# Altium project QMK_PERI_CORNIX_V3.PrjPcb
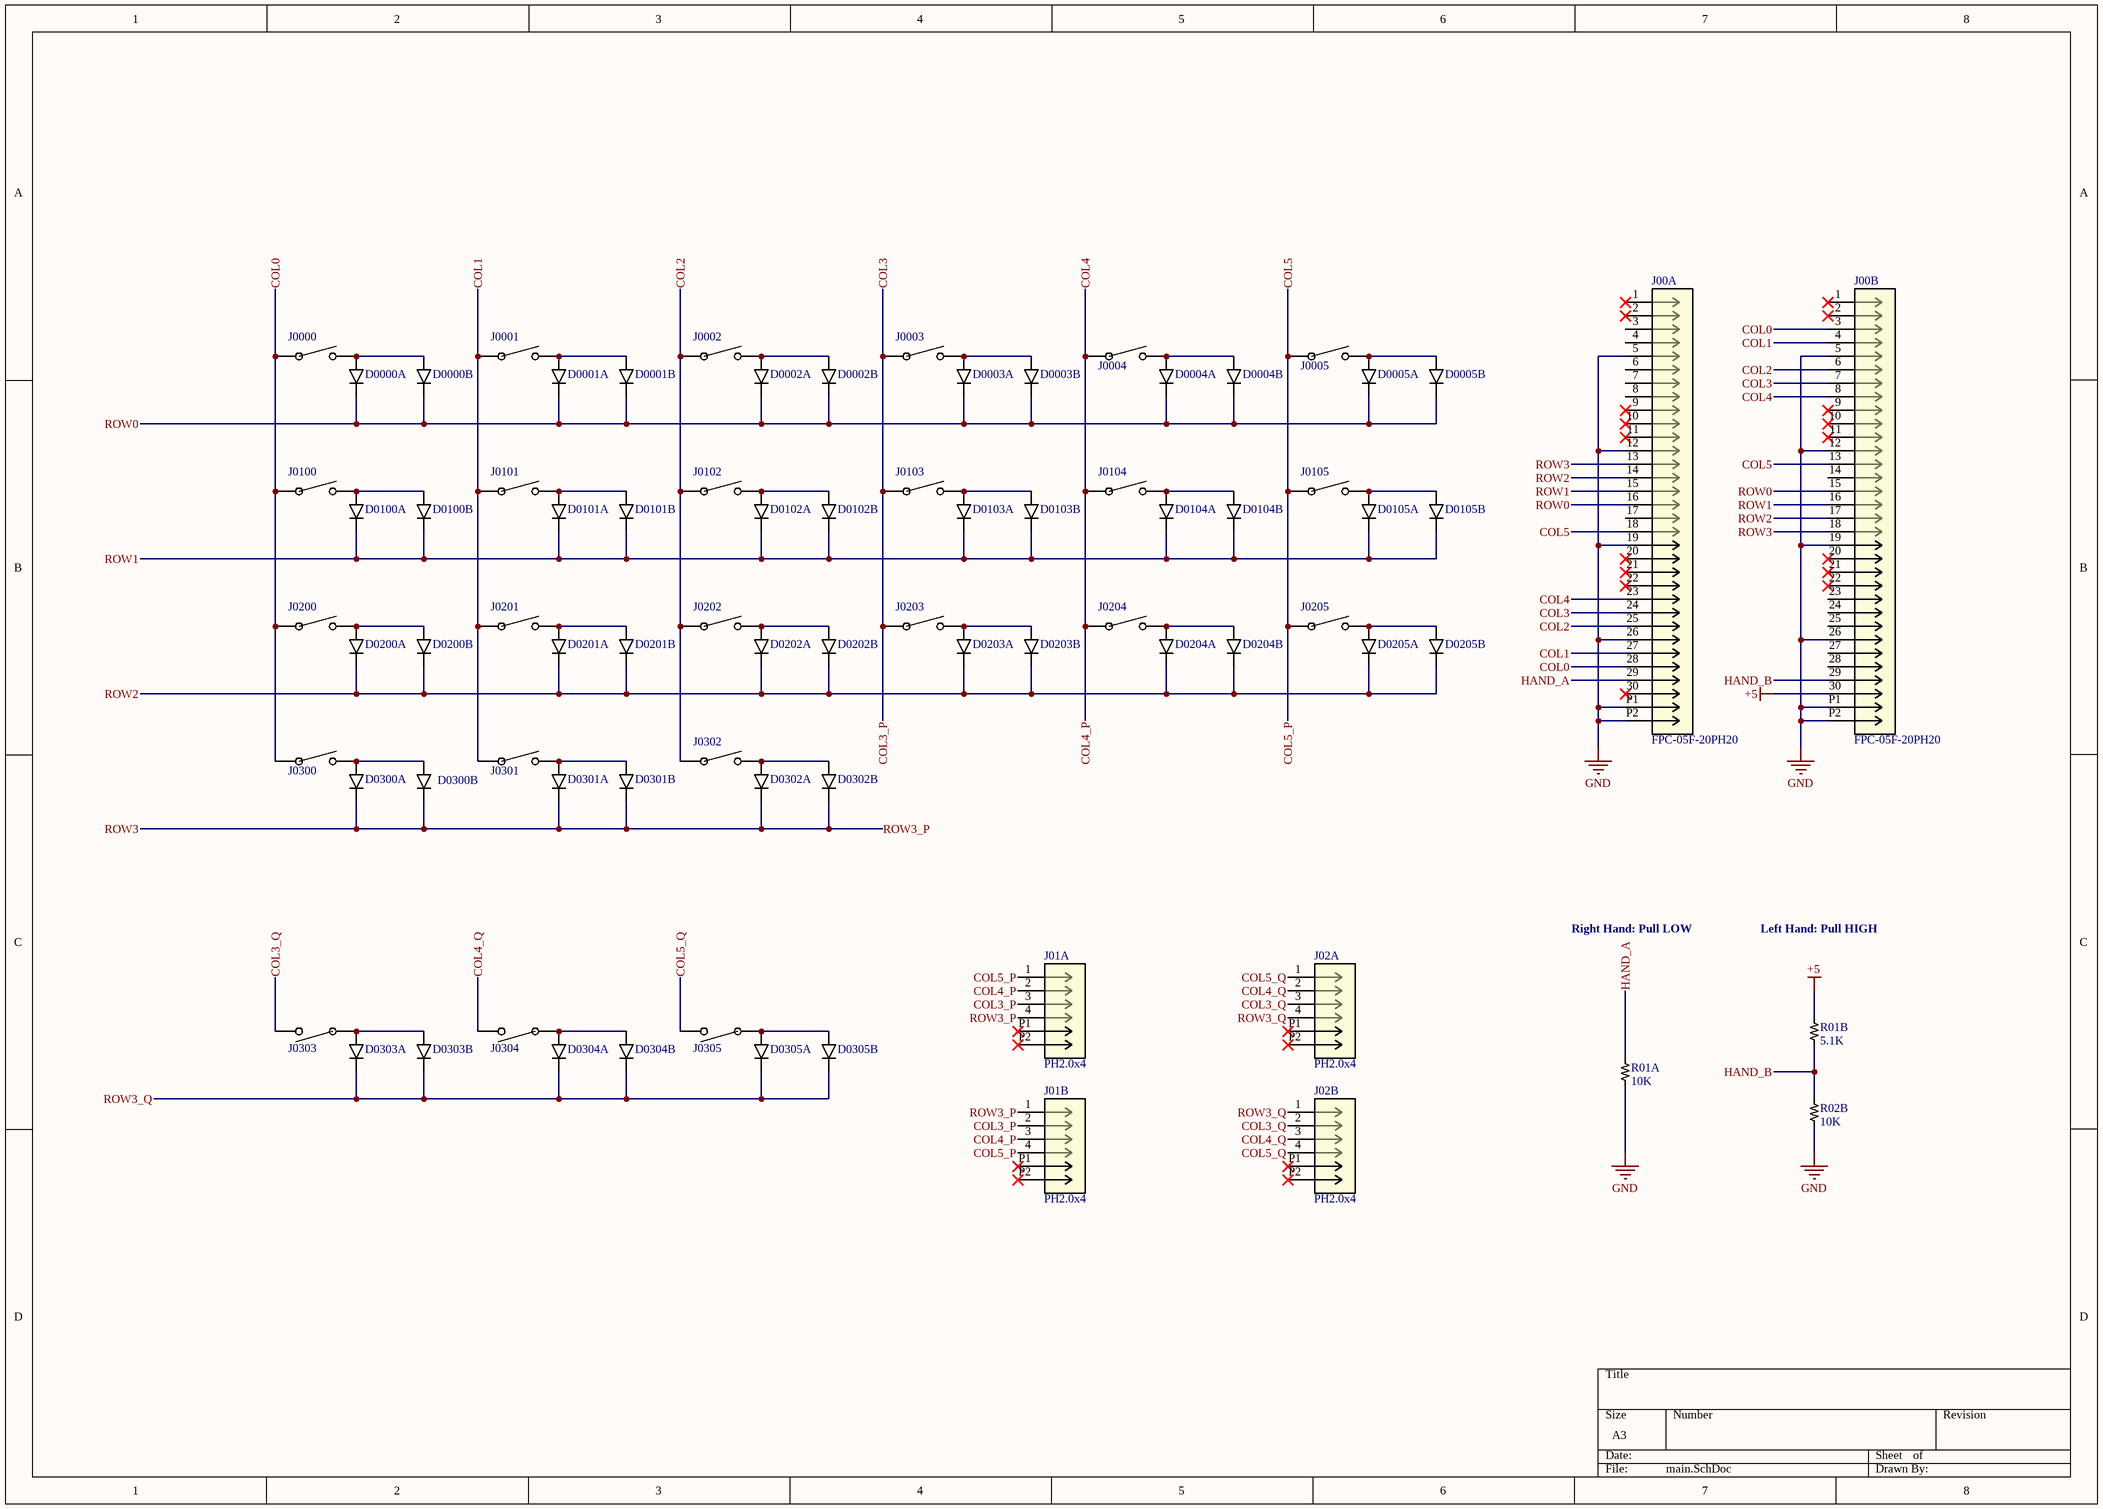
[diagram p0: main.SchDoc]
1 sheet, 81 parts. Net scope: global (net labels, ports and power ports of the same name join across sheets).
Board file: main_V3.0.PcbDoc

## Sheet main.SchDoc
size A3; SheetNumber: 1; SheetTotal: 1

### Parts
D0000A  1N4148W  [SOD123_DIO]  (value not drawn)
D0000B  1N4148W  [SOD123_DIO]  (value not drawn)
D0001A  1N4148W  [SOD123_DIO]  (value not drawn)
D0001B  1N4148W  [SOD123_DIO]  (value not drawn)
D0002A  1N4148W  [SOD123_DIO]  (value not drawn)
D0002B  1N4148W  [SOD123_DIO]  (value not drawn)
D0003A  1N4148W  [SOD123_DIO]  (value not drawn)
D0003B  1N4148W  [SOD123_DIO]  (value not drawn)
D0004A  1N4148W  [SOD123_DIO]  (value not drawn)
D0004B  1N4148W  [SOD123_DIO]  (value not drawn)
D0005A  1N4148W  [SOD123_DIO]  (value not drawn)
D0005B  1N4148W  [SOD123_DIO]  (value not drawn)
D0100A  1N4148W  [SOD123_DIO]  (value not drawn)
D0100B  1N4148W  [SOD123_DIO]  (value not drawn)
D0101A  1N4148W  [SOD123_DIO]  (value not drawn)
D0101B  1N4148W  [SOD123_DIO]  (value not drawn)
D0102A  1N4148W  [SOD123_DIO]  (value not drawn)
D0102B  1N4148W  [SOD123_DIO]  (value not drawn)
D0103A  1N4148W  [SOD123_DIO]  (value not drawn)
D0103B  1N4148W  [SOD123_DIO]  (value not drawn)
D0104A  1N4148W  [SOD123_DIO]  (value not drawn)
D0104B  1N4148W  [SOD123_DIO]  (value not drawn)
D0105A  1N4148W  [SOD123_DIO]  (value not drawn)
D0105B  1N4148W  [SOD123_DIO]  (value not drawn)
D0200A  1N4148W  [SOD123_DIO]  (value not drawn)
D0200B  1N4148W  [SOD123_DIO]  (value not drawn)
D0201A  1N4148W  [SOD123_DIO]  (value not drawn)
D0201B  1N4148W  [SOD123_DIO]  (value not drawn)
D0202A  1N4148W  [SOD123_DIO]  (value not drawn)
D0202B  1N4148W  [SOD123_DIO]  (value not drawn)
D0203A  1N4148W  [SOD123_DIO]  (value not drawn)
D0203B  1N4148W  [SOD123_DIO]  (value not drawn)
D0204A  1N4148W  [SOD123_DIO]  (value not drawn)
D0204B  1N4148W  [SOD123_DIO]  (value not drawn)
D0205A  1N4148W  [SOD123_DIO]  (value not drawn)
D0205B  1N4148W  [SOD123_DIO]  (value not drawn)
D0300A  1N4148W  [SOD123_DIO]  (value not drawn)
D0300B  1N4148W  [SOD123_DIO]  (value not drawn)
D0301A  1N4148W  [SOD123_DIO]  (value not drawn)
D0301B  1N4148W  [SOD123_DIO]  (value not drawn)
D0302A  1N4148W  [SOD123_DIO]  (value not drawn)
D0302B  1N4148W  [SOD123_DIO]  (value not drawn)
D0303A  1N4148W  [SOD123_DIO]  (value not drawn)
D0303B  1N4148W  [SOD123_DIO]  (value not drawn)
D0304A  1N4148W  [SOD123_DIO]  (value not drawn)
D0304B  1N4148W  [SOD123_DIO]  (value not drawn)
D0305A  1N4148W  [SOD123_DIO]  (value not drawn)
D0305B  1N4148W  [SOD123_DIO]  (value not drawn)
J0000  Gateron_V2  [Gateron_V2]  (value not drawn)
J00A  FPC-05F-20PH20  [FPC-05F-30PH20]
J00B  FPC-05F-20PH20  [FPC-05F-30PH20]
J0001  Gateron_V2  [Gateron_V2]  (value not drawn)
J01A  PH2.0x4  [PH2.0x4P]
J01B  PH2.0x4  [PH2.0x4P]
J0002  Gateron_V2  [Gateron_V2]  (value not drawn)
J02A  PH2.0x4  [PH2.0x4P]
J02B  PH2.0x4  [PH2.0x4P]
J0003  Gateron_V2  [Gateron_V2]  (value not drawn)
J0004  Gateron_V2  [Gateron_V2]  (value not drawn)
J0005  Gateron_V2  [Gateron_V2]  (value not drawn)
J0100  Gateron_V2  [Gateron_V2]  (value not drawn)
J0101  Gateron_V2  [Gateron_V2]  (value not drawn)
J0102  Gateron_V2  [Gateron_V2]  (value not drawn)
J0103  Gateron_V2  [Gateron_V2]  (value not drawn)
J0104  Gateron_V2  [Gateron_V2]  (value not drawn)
J0105  Gateron_V2  [Gateron_V2]  (value not drawn)
J0200  Gateron_V2  [Gateron_V2]  (value not drawn)
J0201  Gateron_V2  [Gateron_V2]  (value not drawn)
J0202  Gateron_V2  [Gateron_V2]  (value not drawn)
J0203  Gateron_V2  [Gateron_V2]  (value not drawn)
J0204  Gateron_V2  [Gateron_V2]  (value not drawn)
J0205  Gateron_V2  [Gateron_V2]  (value not drawn)
J0300  Gateron_V2  [Gateron_V2]  (value not drawn)
J0301  Gateron_V2  [Gateron_V2]  (value not drawn)
J0302  Gateron_V2  [Gateron_V2]  (value not drawn)
J0303  Gateron_V2  [Gateron_V2]  (value not drawn)
J0304  Gateron_V2  [Gateron_V2]  (value not drawn)
J0305  Gateron_V2  [Gateron_V2]  (value not drawn)
R01A  10K  [RES0402_CPF_TYCO_TYC]
R01B  5.1K  [RES0402_CPF_TYCO_TYC]
R02B  10K  [RES0402_CPF_TYCO_TYC]

### Nets
+5: J00B.30 R01B.1
GND: J00A.5 J00A.12 J00A.19 J00A.26 J00A.P1 J00A.P2 J00B.5 J00B.12 J00B.19 J00B.26 J00B.P1 J00B.P2 R01A.2 R02B.2
COL0: J0000.1 J00A.28 J00B.3 J0100.1 J0200.1 J0300.1
COL1: J00A.27 J00B.4 J0001.1 J0101.1 J0201.1 J0301.1
COL2: J00A.25 J00B.6 J0002.1 J0102.1 J0202.1 J0302.1
COL3: J00A.24 J00B.7 J01A.3 J01B.2 J0003.1 J0103.1 J0203.1  [also labelled COL3_P]
COL3_Q: J02A.3 J02B.2 J0303.2
COL4: J00A.23 J00B.8 J01A.2 J01B.3 J0004.1 J0104.1 J0204.1  [also labelled COL4_P]
COL4_Q: J02A.2 J02B.3 J0304.2
COL5: J00A.18 J00B.13 J01A.1 J01B.4 J0005.1 J0105.1 J0205.1  [also labelled COL5_P]
COL5_Q: J02A.1 J02B.4 J0305.2
HAND_A: J00A.29 R01A.1
HAND_B: J00B.29 R01B.2 R02B.1
ROW0: D0000A.K D0000B.K D0001A.K D0001B.K D0002A.K D0002B.K D0003A.K D0003B.K D0004A.K D0004B.K D0005A.K D0005B.K J00A.16 J00B.15
ROW1: D0100A.K D0100B.K D0101A.K D0101B.K D0102A.K D0102B.K D0103A.K D0103B.K D0104A.K D0104B.K D0105A.K D0105B.K J00A.15 J00B.16
ROW2: D0200A.K D0200B.K D0201A.K D0201B.K D0202A.K D0202B.K D0203A.K D0203B.K D0204A.K D0204B.K D0205A.K D0205B.K J00A.14 J00B.17
ROW3: D0300A.K D0300B.K D0301A.K D0301B.K D0302A.K D0302B.K J00A.13 J00B.18 J01A.4 J01B.1  [also labelled ROW3_P]
ROW3_Q: D0303A.K D0303B.K D0304A.K D0304B.K D0305A.K D0305B.K J02A.4 J02B.1
NetD0000A_A: D0000A.A D0000B.A J0000.2
NetD0001A_A: D0001A.A D0001B.A J0001.2
NetD0002A_A: D0002A.A D0002B.A J0002.2
NetD0003A_A: D0003A.A D0003B.A J0003.2
NetD0004A_A: D0004A.A D0004B.A J0004.2
NetD0005A_A: D0005A.A D0005B.A J0005.2
NetD0100A_A: D0100A.A D0100B.A J0100.2
NetD0101A_A: D0101A.A D0101B.A J0101.2
NetD0102A_A: D0102A.A D0102B.A J0102.2
NetD0103A_A: D0103A.A D0103B.A J0103.2
NetD0104A_A: D0104A.A D0104B.A J0104.2
NetD0105A_A: D0105A.A D0105B.A J0105.2
NetD0200A_A: D0200A.A D0200B.A J0200.2
NetD0201A_A: D0201A.A D0201B.A J0201.2
NetD0202A_A: D0202A.A D0202B.A J0202.2
NetD0203A_A: D0203A.A D0203B.A J0203.2
NetD0204A_A: D0204A.A D0204B.A J0204.2
NetD0205A_A: D0205A.A D0205B.A J0205.2
NetD0300A_A: D0300A.A D0300B.A J0300.2
NetD0301A_A: D0301A.A D0301B.A J0301.2
NetD0302A_A: D0302A.A D0302B.A J0302.2
NetD0303A_A: D0303A.A D0303B.A J0303.1
NetD0304A_A: D0304A.A D0304B.A J0304.1
NetD0305A_A: D0305A.A D0305B.A J0305.1

Not connected (* = marked no-connect by the designer): J00A 1* 2* 3 4 6 7 8 9* 10* 11* 17 20* 21* 22* 30*; J00B 1* 2* 9* 10* 11* 14 20* 21* 22* 23 24 25 27 28; J01A P1* P2*; J01B P1* P2*; J02A P1* P2*; J02B P1* P2*

### Notes on the sheet
- Right Hand: Pull LOW
- Left Hand: Pull HIGH

### Library data of the parts
D0000A D0000B D0001A D0001B D0002A D0002B D0003A D0003B D0004A D0004B D0005A D0005B D0100A D0100B D0101A D0101B D0102A D0102B D0103A D0103B D0104A D0104B D0105A D0105B D0200A D0200B D0201A D0201B D0202A D0202B D0203A D0203B D0204A D0204B D0205A D0205B D0300A D0300B D0301A D0301B D0302A D0302B D0303A D0303B D0304A D0304B D0305A D0305B = 1N4148W: Small Signal Diode
J0000 J0001 J0002 J0003 J0004 J0005 J0100 J0101 J0102 J0103 J0104 J0105 J0200 J0201 J0202 J0203 J0204 J0205 J0300 J0301 J0302 J0303 J0304 J0305 = Gateron_V2: Gateron hotswap socket V2.0
J00A J00B = FPC-05F-30PH20: 30 Pin 0.5 Pitch FPC connector
J01A J01B J02A J02B = PH2.0x4: PH2.0 4Pin Connector (vertical SMD)
R01A R01B R02B = R0402: CPF 0402 RL; Manufacturer_Name: TE Connectivity; Manufacturer_Part_Number: CPF0402B33RE1; Copyright: Copyright (C) 2025 Ultra Librarian. All rights reserved.; Datasheet: https://www.te.com/commerce/DocumentDelivery/DDEController?Action=srchrtrv&DocNm=1773200&DocType=Data+Sheet&DocLang=English&PartCntxt=1-1879208-3&DocFormat=pdf